# EAGLE design SEADLight (EAGLE 6.6.0)

## Sheet 1 of 3
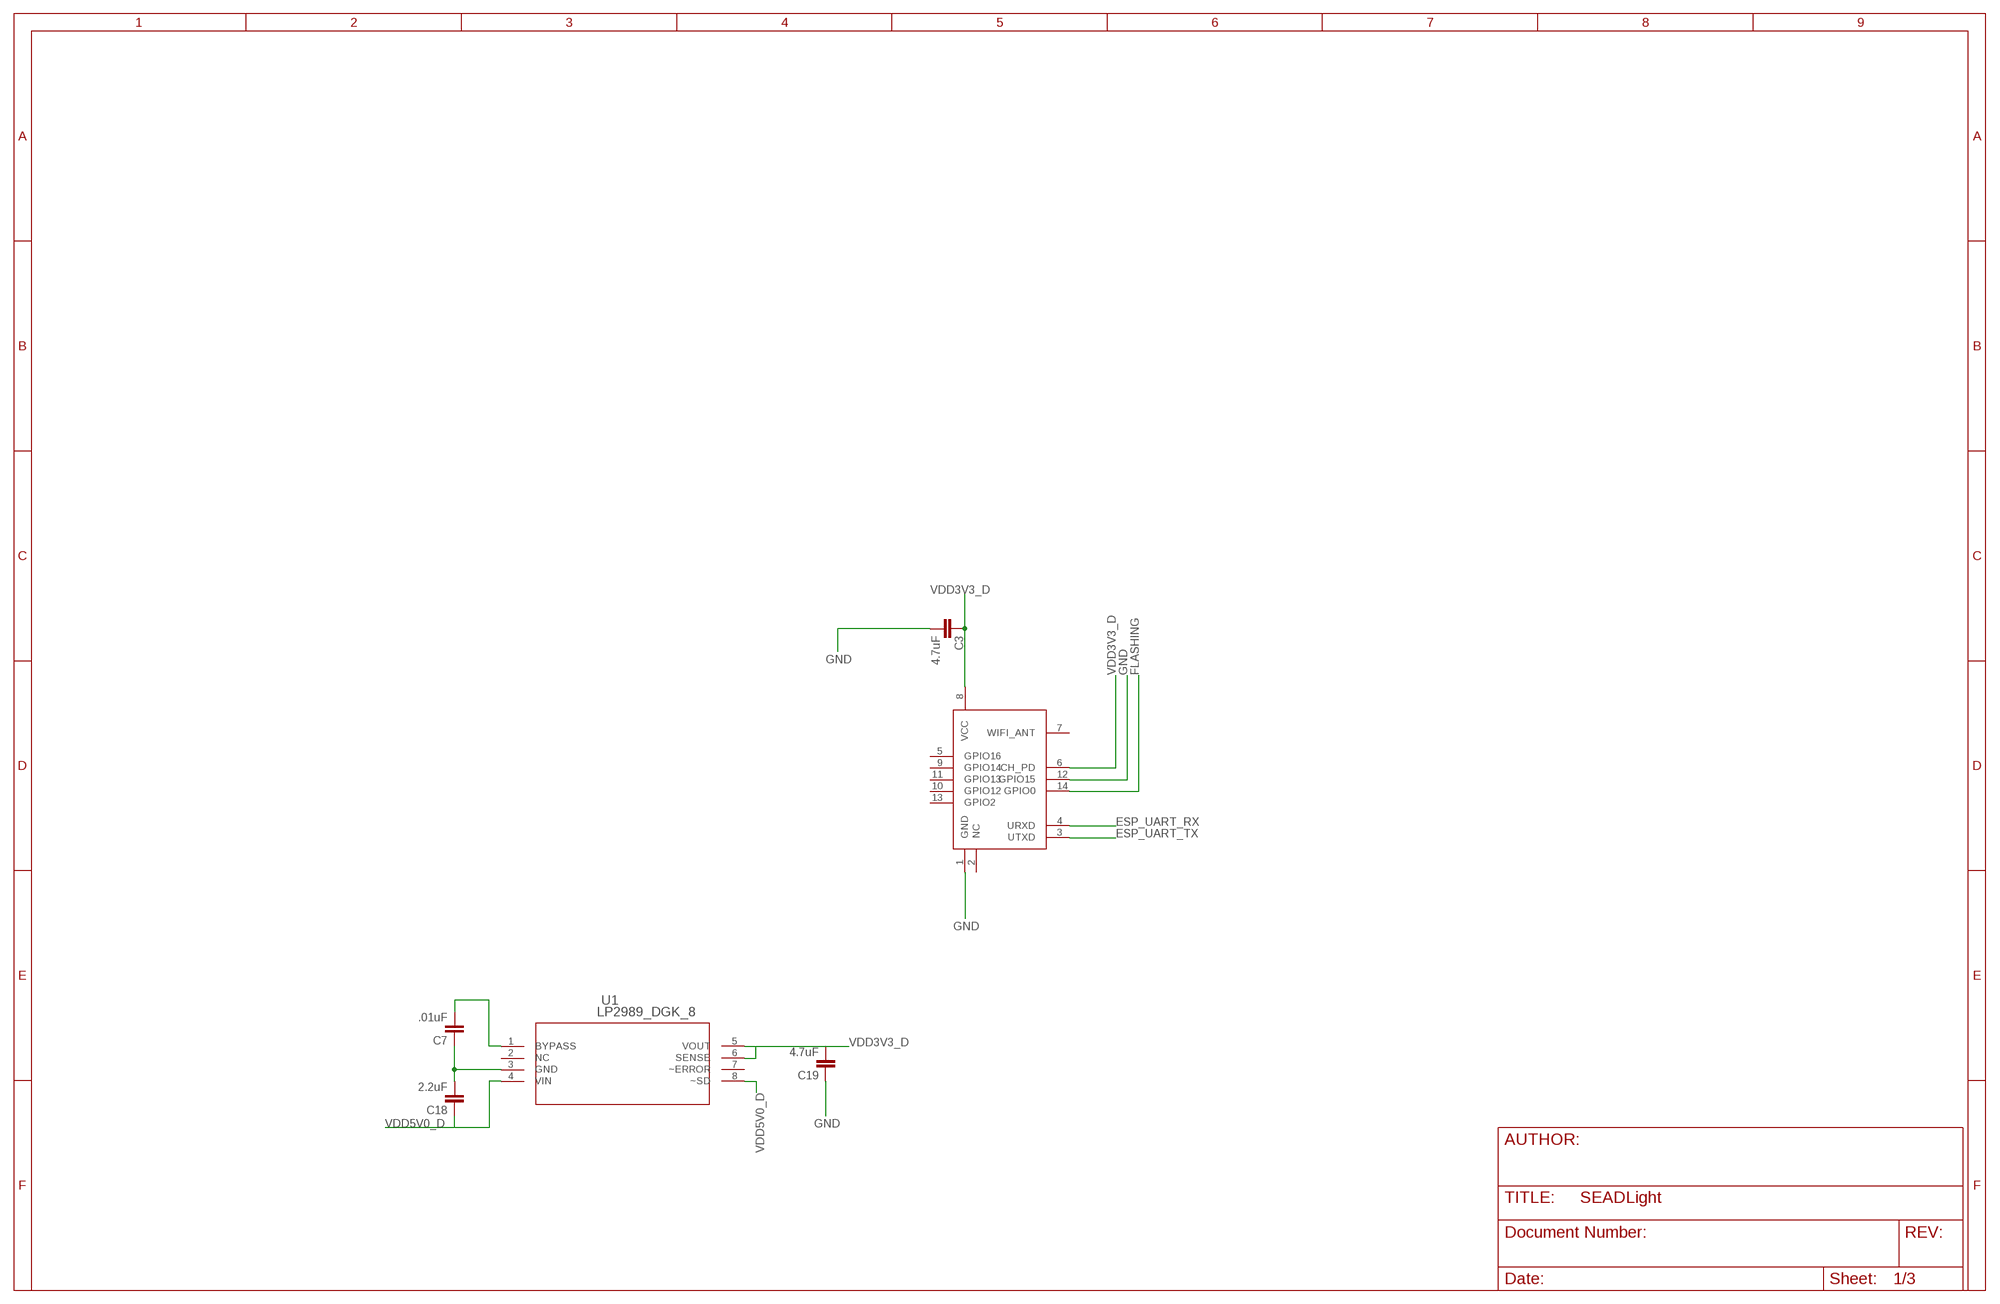
[diagram p0: schematic, sheet 1]

### Parts
C3  4.7uF  CAP0805  [0805]
C7  .01uF  CAP0805  [0805]
C18  2.2uF  CAP0805  [0805]
C19  4.7uF  CAP0805  [0805]
U1  LP2989_DGK_8  [MUA08A]
U$3  EPS8266  [ESP8266-03]

### Nets
ESP_UART_RX: U$3.4(URXD) ; also sheet 2
ESP_UART_TX: U$3.3(UTXD) ; also sheet 2
FLASHING: U$3.14(GPIO0)
GND: C3.2 C7.1 C18.2 C19.1 U1.3(GND) U$3.1(GND) U$3.12(GPIO15) ; also sheet 2
N$23: C7.2 U1.1(BYPASS)
VDD3V3_D: C3.1 C19.2 U1.5(VOUT) U1.6(SENSE) U$3.6(CH_PD) U$3.8(VCC) ; also sheet 2
VDD5V0_D: C18.1 U1.4(VIN) U1.8(~SD) ; also sheet 2
Unconnected: U1.2(NC) U1.7(~ERROR) U$3.2(NC) U$3.5(GPIO16) U$3.7(WIFI_ANT) U$3.9(GPIO14) U$3.10(GPIO12) U$3.11(GPIO13) U$3.13(GPIO2)

## Sheet 2 of 3
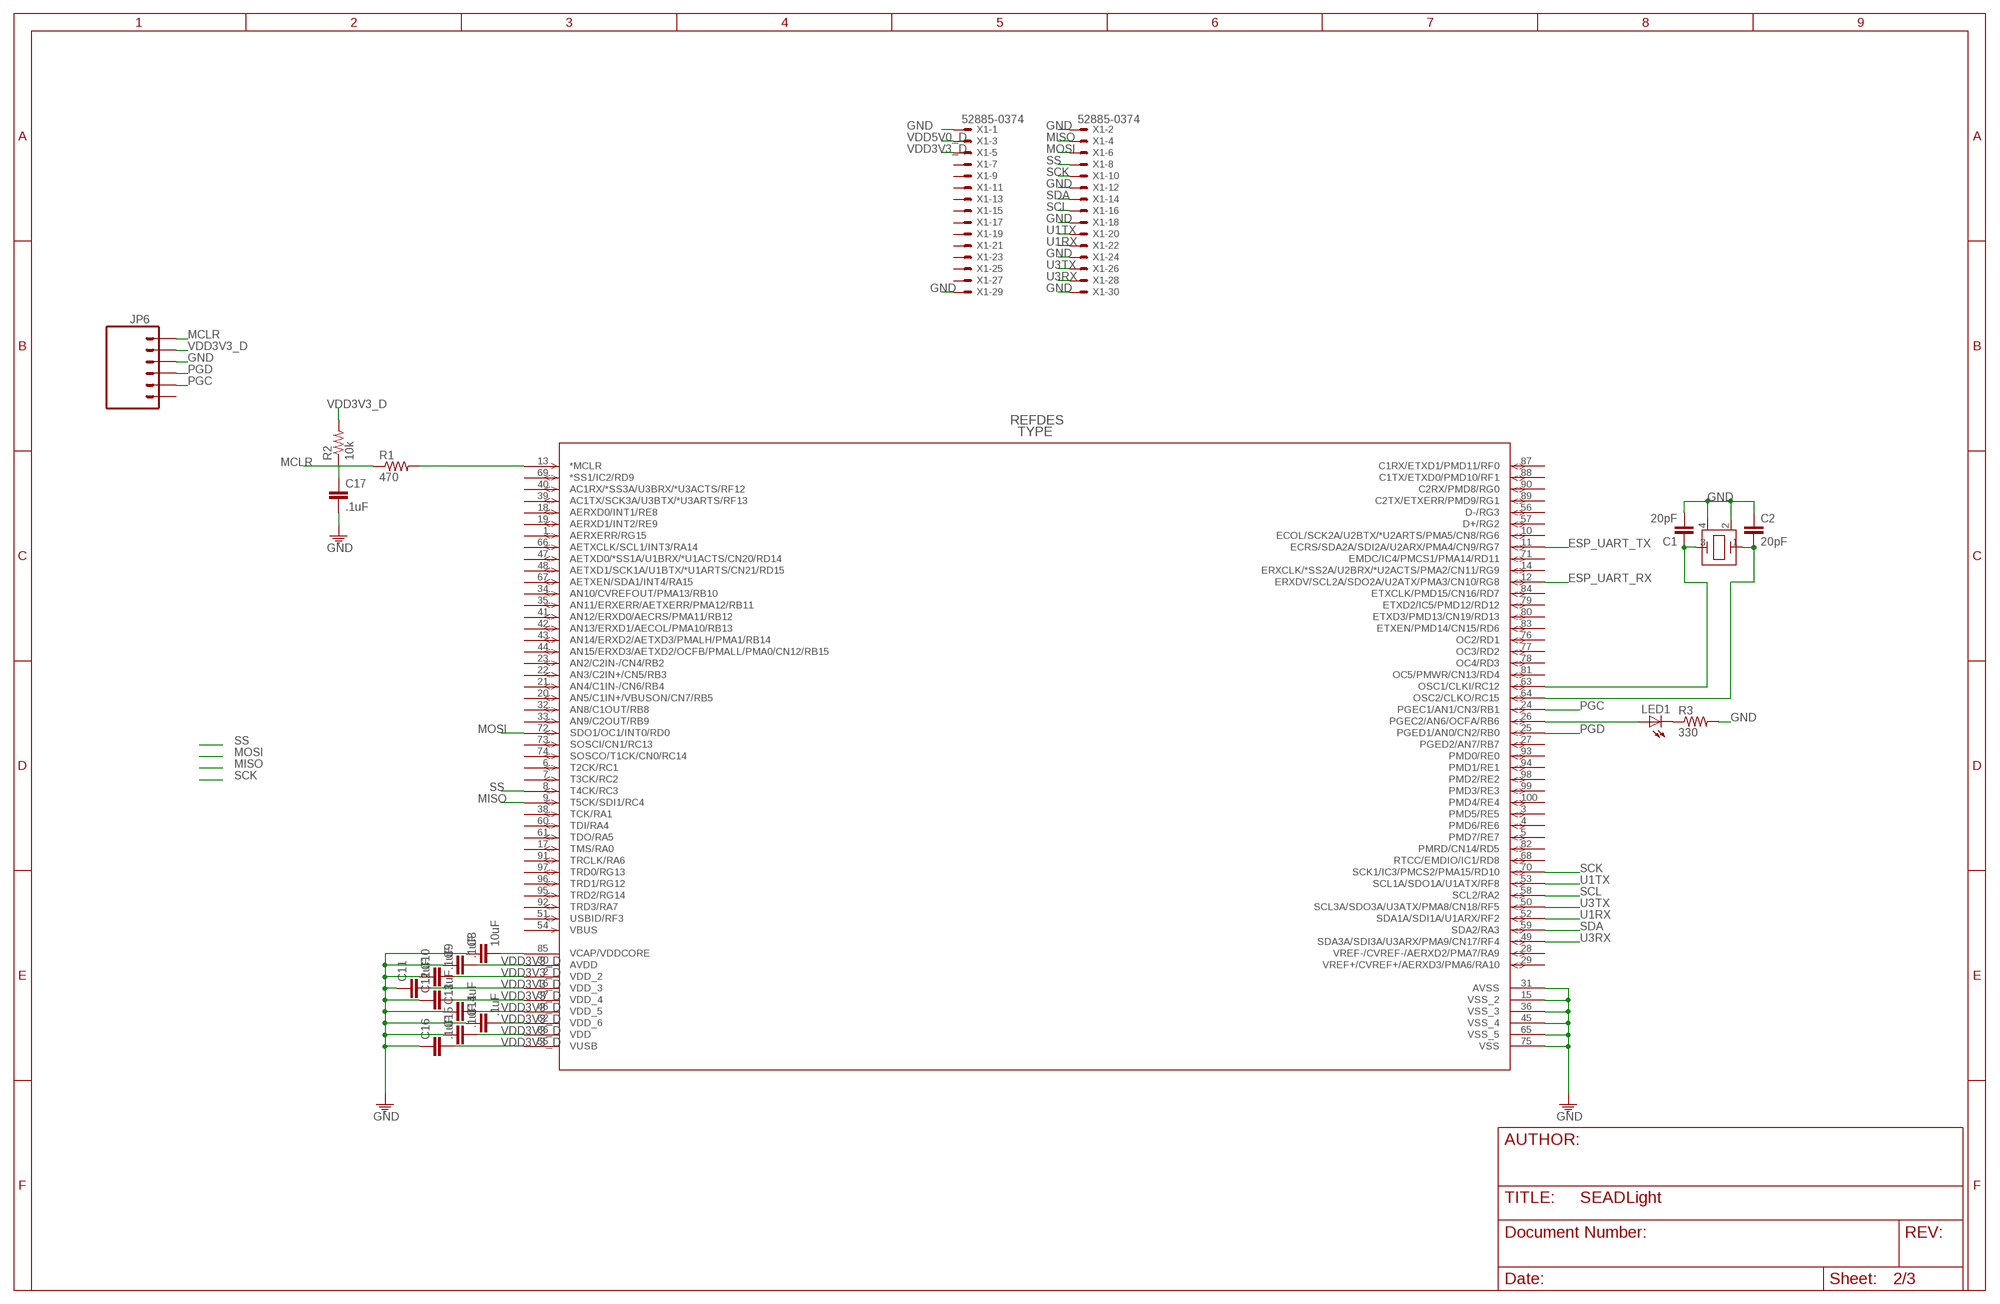
[diagram p1: schematic, sheet 2]

### Parts
C1  20pF  CAP0805  [0805]
C2  20pF  CAP0805  [0805]
C8  10uF  CAP0805  [0805]
C9  .1uF  CAP0805  [0805]
C10  .1uF  CAP0805  [0805]
C11  .1uF  CAP0805  [0805]
C12  .1uF  CAP0805  [0805]
C13  .1uF  CAP0805  [0805]
C14  .1uF  CAP0805  [0805]
C15  .1uF  CAP0805  [0805]
C16  .1uF  CAP0805  [0805]
C17  .1uF  CAP0805  [0805]
JP6  M06SIP_LOCK  [1X06-SIP_LOCK]
LED1  LED0805  [LED-0805]
R1  470  RESISTOR0805-RES  [0805]
R2  10k  RESISTOR0805-RES  [0805]
R3  330  RESISTOR0805-RES  [0805]
U$1  PIC32MX795F512L-  [TQFP100_12X12MC]
U$2  ABM3B-8.000MHZ-10-1-U-T  [ABM3B]
X1  52885-0374  [52885-0374]

### Nets
ESP_UART_RX: U$1.12(ERXDV/SCL2A/SDO2A/U2ATX/PMA3/CN10/RG8) ; also sheet 1
ESP_UART_TX: U$1.11(ECRS/SDA2A/SDI2A/U2ARX/PMA4/CN9/RG7) ; also sheet 1
GND: C1.2 C2.1 C8.1 C9.1 C10.1 C11.1 C12.1 C13.1 C14.1 C15.1 C16.1 C17.2 JP6.3 R3.2 U$1.15(VSS_2) U$1.31(AVSS) U$1.36(VSS_3) U$1.45(VSS_4) U$1.65(VSS_5) U$1.75(VSS) U$2.2(GND1) U$2.4(GND2) X1.1 X1.2 X1.12 X1.18 X1.24 X1.29 X1.30 ; also sheet 1
MCLR: C17.1 JP6.1 R1.1 R2.1
MISO: U$1.9(T5CK/SDI1/RC4) X1.4
MOSI: U$1.72(SDO1/OC1/INT0/RD0) X1.6
N$1: C1.1 U$1.63(OSC1/CLKI/RC12) U$2.3(OSC2)
N$2: C2.2 U$1.64(OSC2/CLKO/RC15) U$2.1(OSC1)
N$4: C8.2 U$1.85(VCAP/VDDCORE)
N$14: R1.2 U$1.13(*MCLR)
N$15: LED1.1(A) U$1.26(PGEC2/AN6/OCFA/RB6)
N$16: LED1.2(C) R3.1
PGC: JP6.5 U$1.24(PGEC1/AN1/CN3/RB1)
PGD: JP6.4 U$1.25(PGED1/AN0/CN2/RB0)
SCK: U$1.70(SCK1/IC3/PMCS2/PMA15/RD10) X1.10
SCL: U$1.58(SCL2/RA2) X1.16
SDA: U$1.59(SDA2/RA3) X1.14
SS: U$1.8(T4CK/RC3) X1.8
U1RX: U$1.52(SDA1A/SDI1A/U1ARX/RF2) X1.22
U1TX: U$1.53(SCL1A/SDO1A/U1ATX/RF8) X1.20
U3RX: U$1.49(SDA3A/SDI3A/U3ARX/PMA9/CN17/RF4) X1.28
U3TX: U$1.50(SCL3A/SDO3A/U3ATX/PMA8/CN18/RF5) X1.26
VDD3V3_D: C9.2 C10.2 C11.2 C12.2 C13.2 C14.2 C15.2 C16.2 JP6.2 R2.2 U$1.2(VDD_2) U$1.16(VDD_3) U$1.30(AVDD) U$1.37(VDD_4) U$1.46(VDD_5) U$1.55(VUSB) U$1.62(VDD_6) U$1.86(VDD) X1.5 ; also sheet 1
VDD5V0_D: X1.3 ; also sheet 1
Unconnected: JP6.6 U$1.1(AERXERR/RG15) U$1.3(PMD5/RE5) U$1.4(PMD6/RE6) U$1.5(PMD7/RE7) U$1.6(T2CK/RC1) U$1.7(T3CK/RC2) U$1.10(ECOL/SCK2A/U2BTX/*U2ARTS/PMA5/CN8/RG6) U$1.14(ERXCLK/*SS2A/U2BRX/*U2ACTS/PMA2/CN11/RG9) U$1.17(TMS/RA0) U$1.18(AERXD0/INT1/RE8) U$1.19(AERXD1/INT2/RE9) U$1.20(AN5/C1IN+/VBUSON/CN7/RB5) U$1.21(AN4/C1IN-/CN6/RB4) U$1.22(AN3/C2IN+/CN5/RB3) U$1.23(AN2/C2IN-/CN4/RB2) U$1.27(PGED2/AN7/RB7) U$1.28(VREF-/CVREF-/AERXD2/PMA7/RA9) U$1.29(VREF+/CVREF+/AERXD3/PMA6/RA10) U$1.32(AN8/C1OUT/RB8) U$1.33(AN9/C2OUT/RB9) U$1.34(AN10/CVREFOUT/PMA13/RB10) U$1.35(AN11/ERXERR/AETXERR/PMA12/RB11) U$1.38(TCK/RA1) U$1.39(AC1TX/SCK3A/U3BTX/*U3ARTS/RF13) U$1.40(AC1RX/*SS3A/U3BRX/*U3ACTS/RF12) U$1.41(AN12/ERXD0/AECRS/PMA11/RB12) U$1.42(AN13/ERXD1/AECOL/PMA10/RB13) U$1.43(AN14/ERXD2/AETXD3/PMALH/PMA1/RB14) U$1.44(AN15/ERXD3/AETXD2/OCFB/PMALL/PMA0/CN12/RB15) U$1.47(AETXD0/*SS1A/U1BRX/*U1ACTS/CN20/RD14) U$1.48(AETXD1/SCK1A/U1BTX/*U1ARTS/CN21/RD15) U$1.51(USBID/RF3) U$1.54(VBUS) U$1.56(D-/RG3) U$1.57(D+/RG2) U$1.60(TDI/RA4) U$1.61(TDO/RA5) U$1.66(AETXCLK/SCL1/INT3/RA14) U$1.67(AETXEN/SDA1/INT4/RA15) U$1.68(RTCC/EMDIO/IC1/RD8) U$1.69(*SS1/IC2/RD9) U$1.71(EMDC/IC4/PMCS1/PMA14/RD11) U$1.73(SOSCI/CN1/RC13) U$1.74(SOSCO/T1CK/CN0/RC14) U$1.76(OC2/RD1) U$1.77(OC3/RD2) U$1.78(OC4/RD3) U$1.79(ETXD2/IC5/PMD12/RD12) U$1.80(ETXD3/PMD13/CN19/RD13) U$1.81(OC5/PMWR/CN13/RD4) U$1.82(PMRD/CN14/RD5) U$1.83(ETXEN/PMD14/CN15/RD6) U$1.84(ETXCLK/PMD15/CN16/RD7) U$1.87(C1RX/ETXD1/PMD11/RF0) U$1.88(C1TX/ETXD0/PMD10/RF1) U$1.89(C2TX/ETXERR/PMD9/RG1) U$1.90(C2RX/PMD8/RG0) U$1.91(TRCLK/RA6) U$1.92(TRD3/RA7) U$1.93(PMD0/RE0) U$1.94(PMD1/RE1) U$1.95(TRD2/RG14) U$1.96(TRD1/RG12) U$1.97(TRD0/RG13) U$1.98(PMD2/RE2) U$1.99(PMD3/RE3) U$1.100(PMD4/RE4) X1.7 X1.9 X1.11 X1.13 X1.15 X1.17 X1.19 X1.21 X1.23 X1.25 X1.27

## Sheet 3 of 3
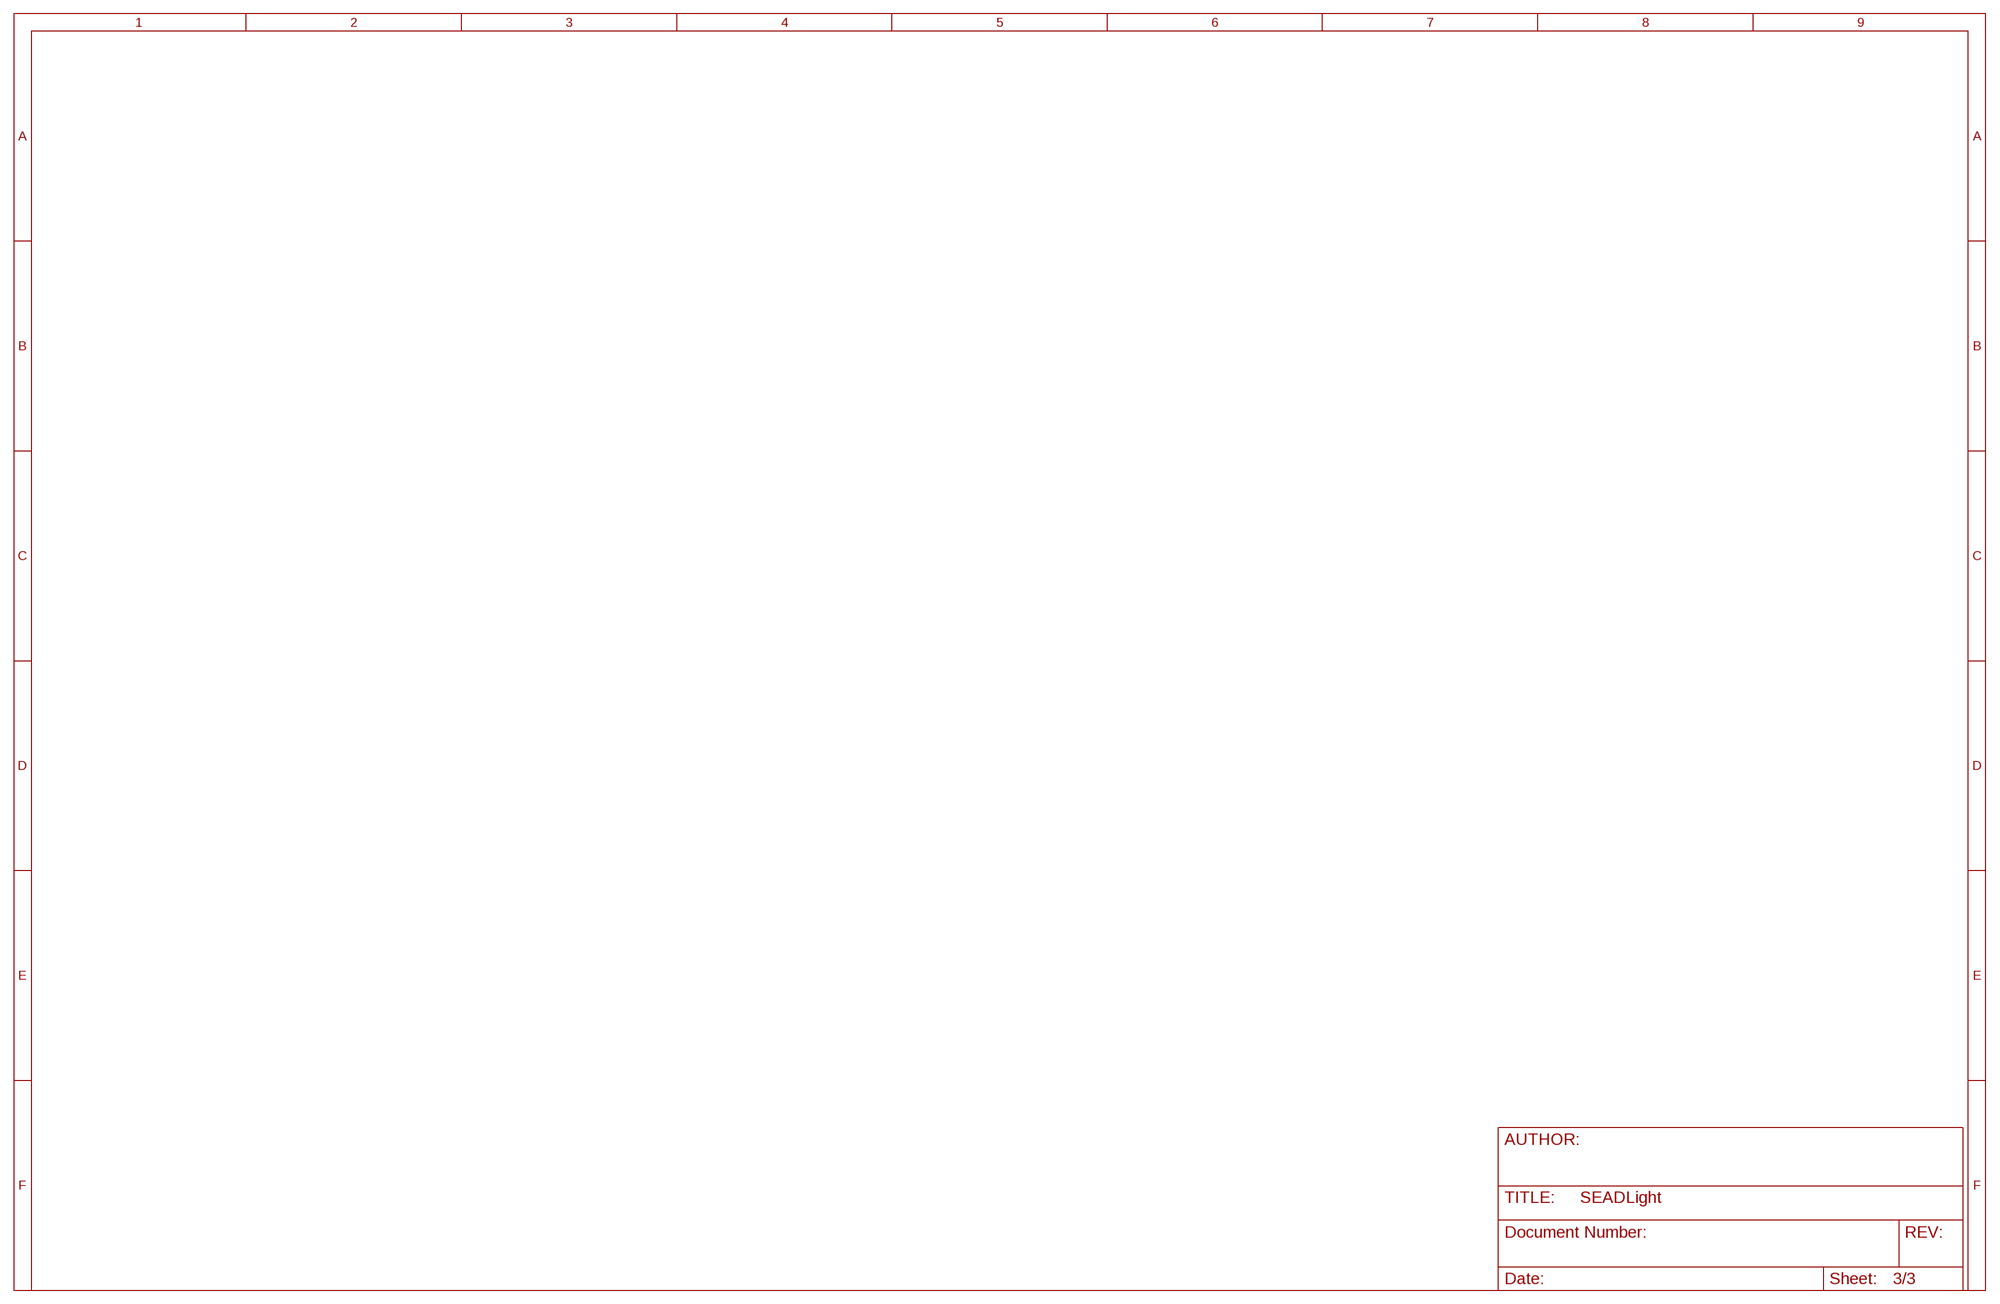
[diagram p2: schematic, sheet 3]

## Library data of the parts
C1-C3 C7-C19 = SensorCape:CAP: Capacitor Standard 0603 ceramic capacitor, and 0.1" leaded capacitor.
JP6 = ASL:M06: Header 6 Standard 6-pin 0.1" header. Use with straight break away headers (SKU : PRT-00116), right angle break away headers (PRT-00553), swiss pins (PRT-00743), machine pins (PRT-00117), and female headers (PRT-00115). Molex polarized connector foot print use with SKU : PRT-08094 with associated crimp pins and housings. NOTES ON THE VARIANTS LOCK and LOCK_LONGPADS... This footprint was designed to help hold the alignment of a through-hole component (i.e. 6-pin header) while soldering it into place. You may notice that each hole has been shifted either up or down by 0.005 of an inch from it's more standard position (which is a perfectly straight line). This slight alteration caused the pins (the squares in the middle) to touch the edges of the holes. Because they are alternating, it causes a "brace" to hold the component in place. 0.005 has proven to be the perfect amount of "off-center" position when using our standard breakaway headers. Although looks a little odd when you look at the bare footprint, once you have a header in there, the alteration is very hard to notice. Also, if you push a header all the way into place, it is covered up entirely on the bottom side. This idea of altering the position of holes to aid alignment will be further integrated into the Sparkfun Library for other footprints. It can help hold any component with 3 or more connection pins.
LED1 = ASL:LED: LEDs Standard schematic elements and footprints for 5mm, 3mm, 1206, and 0603 sized LEDs. 5mm - Spark Fun Electronics SKU : COM-00529 (and others)
R1-R3 = SensorCape:RESISTOR: Resistor Basic schematic elements and footprints for 0603, 1206, and PTH resistors.
U1 = SensorCape:LP2989_DGK_8; BASE_PN: LP2989; COMP: TypeLDO; LIBRARY: ReferenceLP2989AIMM; PARTNUMBER: LP2989AIMM-25; PIN: Count8; SYMBOL: NameLP2989AIMM-25; TYPE: LP2989AIMM-2.5; VENDOR: NationalSemiconductor; VERSION: 1
U$1 = SensorCape:PIC32MX795F512L-
U$2 = SensorCape:ABM3B-8.000MHZ-10-1-U-T
U$3 = SensorCape:EPS8266
X1 = SensorCape:52885-0374: MOLEX Connector SD-52760-**79 Source: 52760-1079_sd molex.pdf; MPN: 52760-0379; OC_FARNELL: unknown; OC_NEWARK: 92M6431

## Board
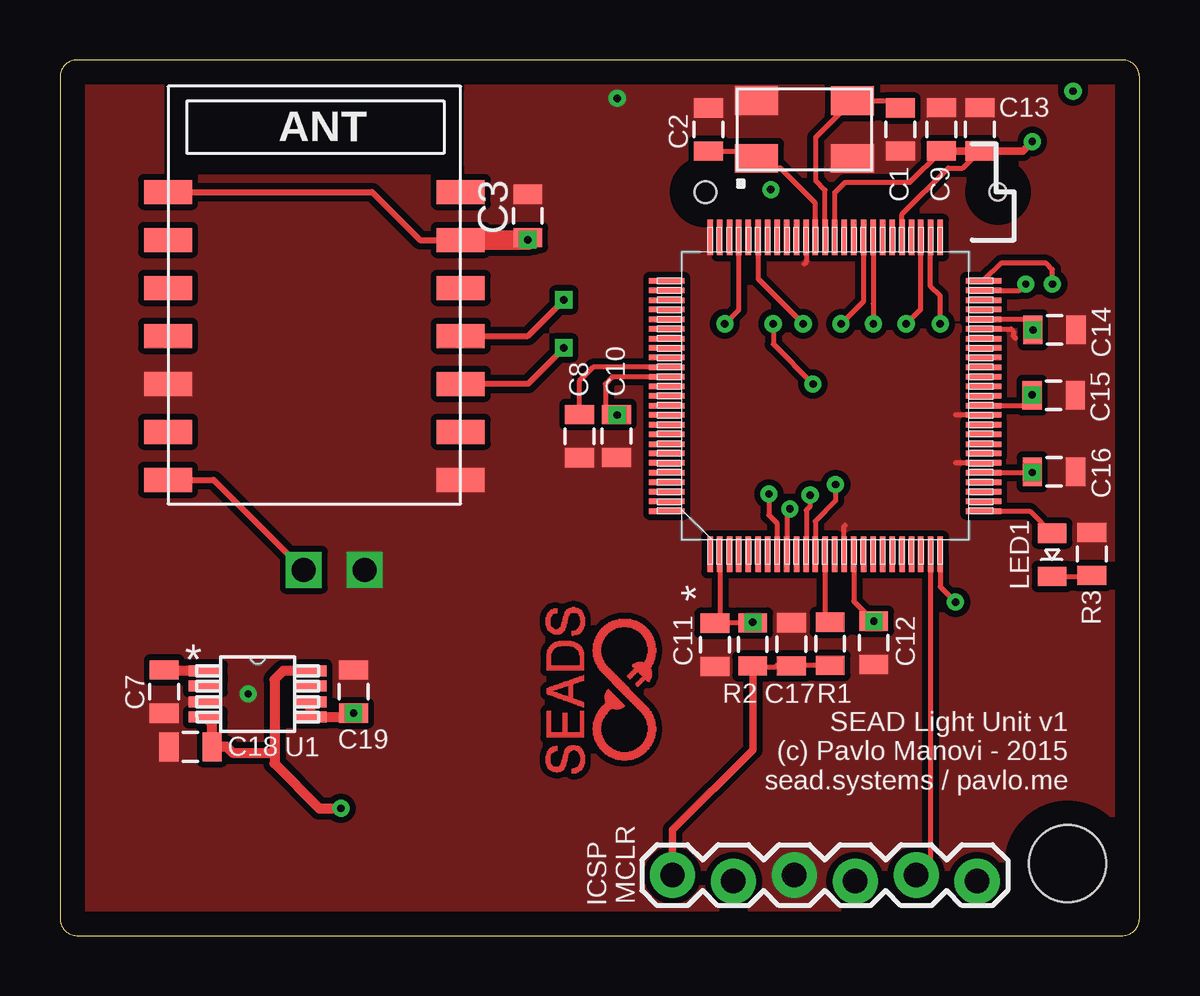
[diagram p3: board, top side]
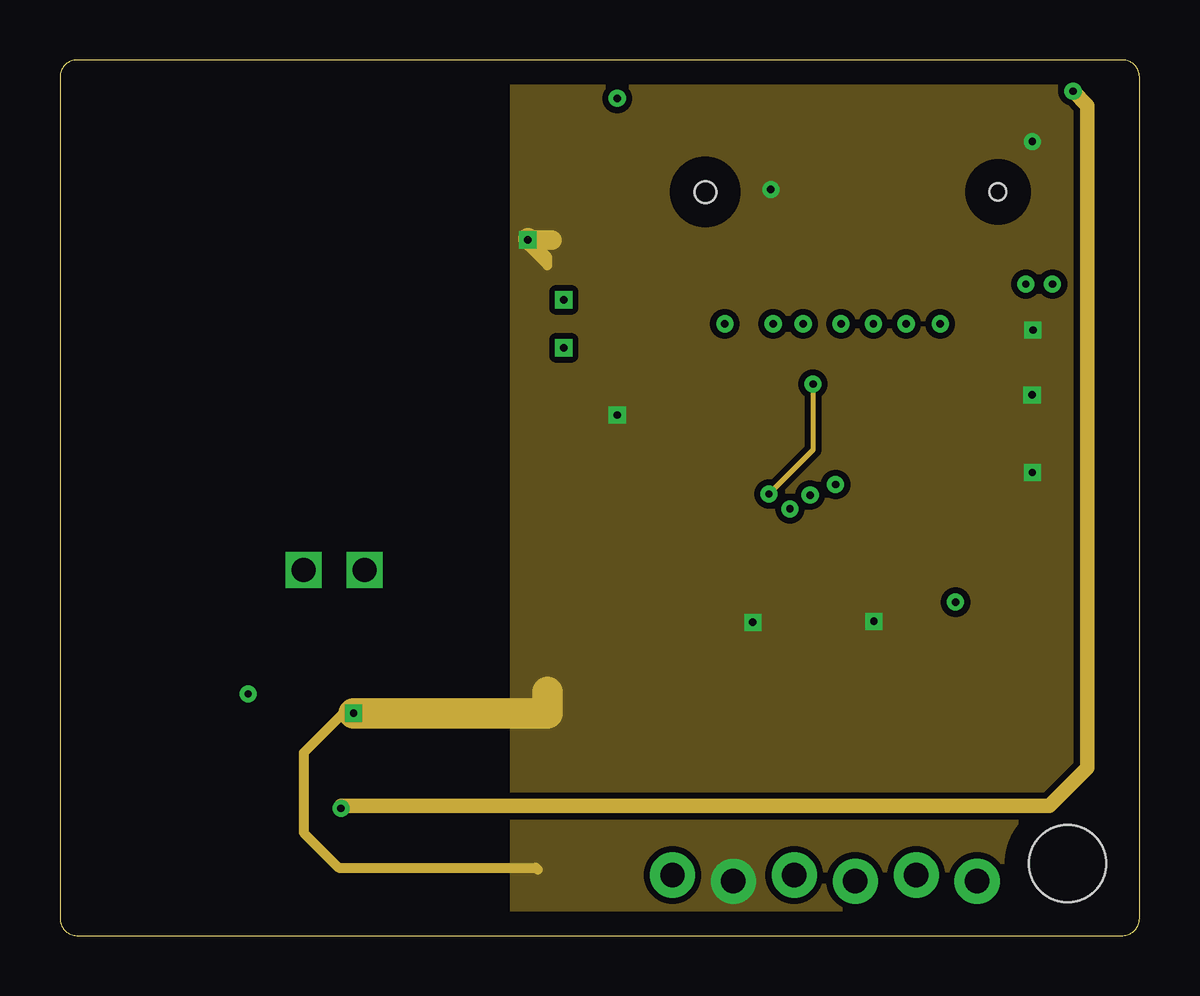
[diagram p4: board, inner layer Route14]
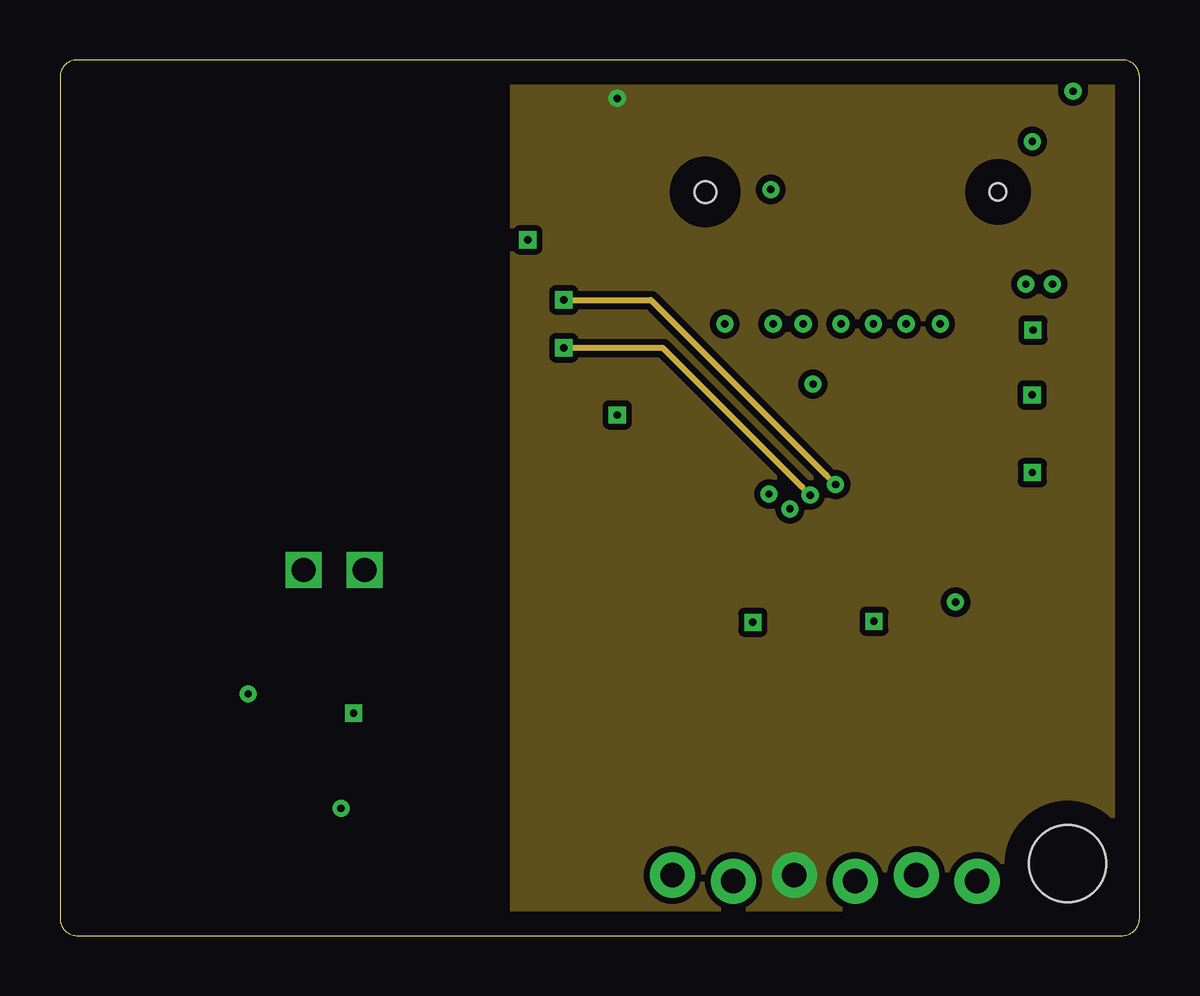
[diagram p5: board, inner layer Route15]
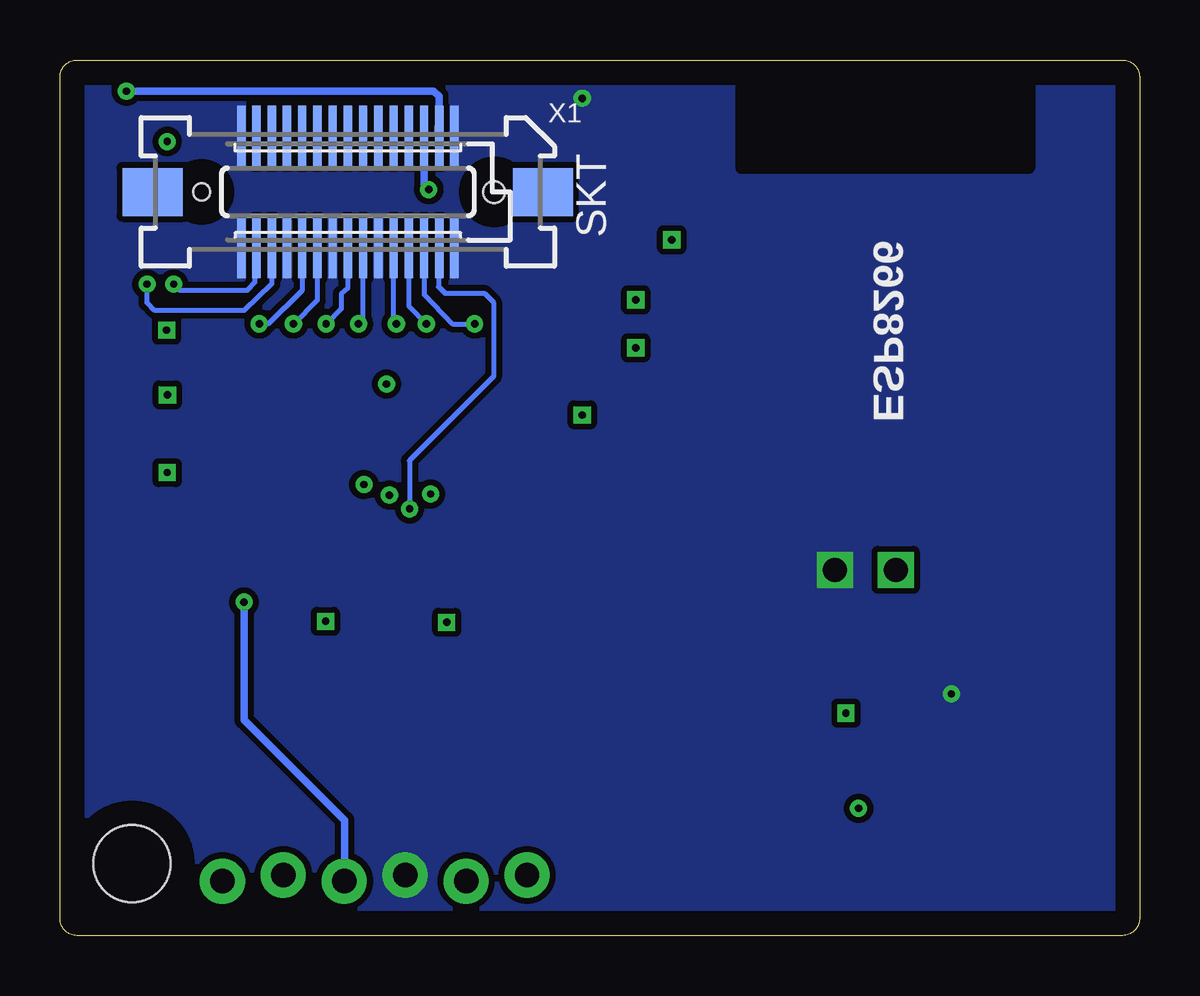
[diagram p6: board, bottom side, seen from below]

Size 45 x 36.5 mm. Coordinates in mm from the lower left corner, seen from the top.
Outline: 0.71,0 44.29,0 arc90 45,0.71 45,35.79 arc90 44.29,36.5 0.71,36.5 arc90 0,35.79 0,0.71 arc90 0.71,0
Copper layers (1*14+15*16): Top 0.035mm / dielectric 1.5mm / Route14 0.035mm / dielectric 0.15mm / Route15 0.035mm / dielectric 0.2mm / Bottom 0.035mm
Design rules "default *": minimum track width 10mil, minimum drill 24mil, track to track 8mil, track to pad 8mil, pad to pad 8mil, via to via 8mil, smd to smd 8mil, copper to edge 40mil, drill to drill 8mil, minimum pad ring 10mil, minimum via ring 8mil, stop-mask expansion 4mil, vias tented up to drill 0mil, thermal gap 10mil
Holes 3.2 mm at 42,3

### Footprints (pad centres in the part's own frame; a part is rotated, then mirrored left to right if it is on the bottom)
0805 = smd 0.8 x 1.2: 1 -0.9,0; 2 0.9,0
1X06-SIP_LOCK = drill 1.016 pad 1.88: 1 0,0; 2 2.54,-0.254; 3 5.08,0; 4 7.62,-0.254; 5 10.16,0; 6 12.7,-0.254
LED-0805 = smd 0.8 x 1.2: 1 -0.9,0; 2 0.9,0
MUA08A = smd 1.372 x 0.457: 1 -2.184,0.965; 2 -2.184,0.33; 3 -2.184,-0.33; 4 -2.184,-0.965; 5 2.184,-0.965; 6 2.184,-0.33; 7 2.184,0.33; 8 2.184,0.965
TQFP100_12X12MC = smd 1.473 x 0.229: 1 -6.604,4.801; 2 -6.604,4.394; 3 -6.604,3.988; 4 -6.604,3.607; 5 -6.604,3.2; 6 -6.604,2.794; 7 -6.604,2.388; 8 -6.604,2.007; 9 -6.604,1.6; 10 -6.604,1.194; 11 -6.604,0.787; 12 -6.604,0.406; 13 -6.604,0; 14 -6.604,-0.406; 15 -6.604,-0.787; 16 -6.604,-1.194; 17 -6.604,-1.6; 18 -6.604,-2.007; 19 -6.604,-2.388; 20 -6.604,-2.794; 21 -6.604,-3.2; 22 -6.604,-3.607; 23 -6.604,-3.988; 24 -6.604,-4.394; 25 -6.604,-4.801; 51 6.604,-4.801; 52 6.604,-4.394; 53 6.604,-3.988; 54 6.604,-3.607; 55 6.604,-3.2; 56 6.604,-2.794; 57 6.604,-2.388; 58 6.604,-2.007; 59 6.604,-1.6; 60 6.604,-1.194; 61 6.604,-0.787; 62 6.604,-0.406; 63 6.604,0; 64 6.604,0.406; 65 6.604,0.787; 66 6.604,1.194; 67 6.604,1.6; 68 6.604,2.007; 69 6.604,2.388; 70 6.604,2.794; 71 6.604,3.2; 72 6.604,3.607; 73 6.604,3.988; 74 6.604,4.394; 75 6.604,4.801 | smd 0.229 x 1.473: 26 -4.801,-6.604; 27 -4.394,-6.604; 28 -3.988,-6.604; 29 -3.607,-6.604; 30 -3.2,-6.604; 31 -2.794,-6.604; 32 -2.388,-6.604; 33 -2.007,-6.604; 34 -1.6,-6.604; 35 -1.194,-6.604; 36 -0.787,-6.604; 37 -0.406,-6.604; 38 0,-6.604; 39 0.406,-6.604; 40 0.787,-6.604; 41 1.194,-6.604; 42 1.6,-6.604; 43 2.007,-6.604; 44 2.388,-6.604; 45 2.794,-6.604; 46 3.2,-6.604; 47 3.607,-6.604; 48 3.988,-6.604; 49 4.394,-6.604; 50 4.801,-6.604; 76 4.801,6.604; 77 4.394,6.604; 78 3.988,6.604; 79 3.607,6.604; 80 3.2,6.604; 81 2.794,6.604; 82 2.388,6.604; 83 2.007,6.604; 84 1.6,6.604; 85 1.194,6.604; 86 0.787,6.604; 87 0.406,6.604; 88 0,6.604; 89 -0.406,6.604; 90 -0.787,6.604; 91 -1.194,6.604; 92 -1.6,6.604; 93 -2.007,6.604; 94 -2.388,6.604; 95 -2.794,6.604; 96 -3.2,6.604; 97 -3.607,6.604; 98 -3.988,6.604; 99 -4.394,6.604; 100 -4.801,6.604
ABM3B = smd 1.8 x 1.2: 1 -2,-1.2; 2 2,-1.2; 3 2,1.2; 4 -2,1.2
ESP8266-03 = smd 2 x 1: 1 12.2,1; 2 12.2,3; 3 12.2,5; 4 12.2,7; 5 12.2,9; 6 12.2,11; 7 12.2,13; 8 0,13; 9 0,11; 10 0,9; 11 0,7; 12 0,5; 13 0,3; 14 0,1
52885-0374 = smd 0.35 x 2.5: 1 -4.445,-2.35; 2 -4.445,2.35; 3 -3.81,-2.35; 4 -3.81,2.35; 5 -3.175,-2.35; 6 -3.175,2.35; 7 -2.54,-2.35; 8 -2.54,2.35; 9 -1.905,-2.35; 10 -1.905,2.35; 11 -1.27,-2.35; 12 -1.27,2.35; 13 -0.635,-2.35; 14 -0.635,2.35; 15 0,-2.35; 16 0,2.35; 17 0.635,-2.35; 18 0.635,2.35; 19 1.27,-2.35; 20 1.27,2.35; 21 1.905,-2.35; 22 1.905,2.35; 23 2.54,-2.35; 24 2.54,2.35; 25 3.175,-2.35; 26 3.175,2.35; 27 3.81,-2.35; 28 3.81,2.35; 29 4.445,-2.35; 30 4.445,2.35 | smd 2.5 x 2: M1 -8.137,0; M2 8.137,0 | hole 0.9: -6.098,0 | hole 0.7: 6.098,0

### Placement (x,y rotation side)
C1  35.03,33.6 270 top
C2  27.03,33.6 270 top
C3  19.5,30 90 top
C7  4.34,10.17 90 top
C8  21.66,20.82 90 top
C9  36.74,33.61 270 top
C10  23.2,20.82 90 top
C11  27.3,12.12 90 top
C12  33.92,12.2 90 top
C13  38.34,33.61 270 top
C14  41.46,25.25 180 top
C15  41.42,22.52 180 top
C16  41.43,19.33 180 top
C17  30.48,12.14 90 top
C18  5.44,7.87 180 top
C19  12.24,10.17 270 top
JP6  25.53,2.52 0 top
LED1  41.35,15.87 270 top
R1  32.1,12.16 90 top
R2  28.88,12.13 90 top
R3  43.01,15.9 90 top
U1  8.24,10.07 0 top
U$1  31.89,22.5 90 top
U$2  31.03,33.6 0 top
U$3  4.5,18 0 top
X1  33,31 180 bottom

### Tracks (layer width: path | path; a pad name or v marks a point on that pad's centre or on a via)
ESP_UART_RX  (via drill 0.3)
  Top 0.203: v32.33,18.8 32.33,18.13 31.48,17.28 U$1.12
  Top 0.254: U$3.4 19.5,25 v21,26.5
  Route15 0.203: 31.93,19.2 v32.33,18.8
  Route15 0.254: v21,26.5 24.63,26.5 31.93,19.2
ESP_UART_TX  (via drill 0.3)
  Top 0.203: v31.27,18.36 31.27,17.89 31.11,17.73 U$1.11
  Top 0.254: v21,24.5 19.5,23 U$3.3
  Route15 0.203: 30.93,18.7 v31.27,18.36
  Route15 0.254: 30.93,18.7 25.13,24.5 v21,24.5
FLASHING  (via drill 1)
  Top 0.254: U$3.14 6.4,19 v10.16,15.24
GND  (via drill 0.3, 1)
  Top 0.203: U$1.65 31.11,28.08 31.03,28 | U$1.15 32.68,17.05 32.73,17.1 | U$1.31 37.33,19.7 | U$1.36 37.34,21.71 37.33,21.7 | U$1.45 39.64,25.29 39.73,25.2 39.73,25 39.83,24.9
  other vias: 7.84,10.07 23.23,34.9 12.7,15.24
  pour Top (isolate 0.254, rank 3, no thermals): -1.47,0.1 -1.47,36.9 45.07,36.8 45.07,0
  pour Bottom (isolate 0.254, no thermals): 44.95,0 44.95,36.8 -1.47,36.8 -1.47,0
  pour Route15 (isolate 0.254, no thermals): 44.95,0 44.95,36.8 18.86,36.8 18.86,0
MCLR
  Top 0.203: R1.1 30.51,11.26 C17.1 30.43,11.3 29.93,11.3 29.83,11.2 29.13,11.2 | R2.1 29.09,11.23 29.13,11.2 | 29.13,11.2 28.93,11.2
  Top 0.305: R2.1 28.88,7.75 25.53,4.4 JP6.1
MISO  (via drill 0.3)
  Top 0.203: U$1.9 30.3,17.66 v30.43,17.79
  Bottom 0.203: X1.4 29.22,27.05 28.95,26.78 27.31,26.78 26.93,26.4 26.93,23.3 30.43,19.8 v30.43,17.79
MOSI  (via drill 0.3)
  Top 0.203: U$1.72 28.29,26.08 v27.71,25.5
  Bottom 0.203: X1.6 29.81,28.61 29.81,26.71 28.64,25.5 v27.71,25.5
N$1
  Top 0.203: U$1.63 31.89,31.07 31.51,31.46 31.51,33.28 U$2.3 34.73,34.8 C1.1
N$2
  Top 0.203: U$1.64 31.49,30.54 30.03,32 29.43,32 U$2.1 28.73,32.7 C2.2
N$4
  Top 0.203: U$1.85 22.22,23.69 21.66,23.13 C8.2
N$14
  Top 0.203: U$1.13 31.89,13.27 R1.2
N$15
  Top 0.203: U$1.26 40.43,17.69 LED1.1
N$16
  Top 0.203: LED1.2 42.98,14.97 R3.1
N$23
  Top 0.406: U1.1 4.38,11.04 C7.2
N$25
  Top 0.025: 24.58,7.83 24.58,9.38
PGC
  Top 0.203: U$1.24 36.29,3.12 JP6.5
PGD  (via drill 0.3)
  Top 0.203: U$1.25 36.7,14.53 v37.33,13.9
  Bottom 0.305: v37.33,13.9 37.33,9 33.13,4.8 33.13,2.29 JP6.4
SCK  (via drill 0.3)
  Top 0.203: U$1.70 29.1,27.38 v30.98,25.5
  Bottom 0.203: X1.10 31.09,25.62 v30.98,25.5
SCL  (via drill 0.3)
  Top 0.203: U$1.58 33.9,26.34 v33.91,25.5
  Bottom 0.203: X1.16 33,27 33.28,26.75 33.28,26.13 v33.91,25.5
SDA  (via drill 0.3)
  Top 0.203: U$1.59 33.49,26.43 v32.56,25.5
  Bottom 0.203: X1.14 32.37,25.66 v32.56,25.5
SS  (via drill 0.3)
  Top 0.203: v29.55,18.41 29.55,17.53 29.88,17.2 U$1.8 | v29.73,25.5 29.73,24.65 v31.39,22.99
  Route14 0.203: v31.39,22.99 31.39,20.25 v29.55,18.41
  Bottom 0.203: X1.8 30.46,26.24 v29.73,25.5
U1RX  (via drill 0.3)
  Top 0.203: v36.69,25.5 36.69,26.66 36.29,27.06 U$1.52
  Bottom 0.203: X1.22 34.91,26.89 36.32,25.5 v36.69,25.5
U1TX  (via drill 0.3)
  Top 0.203: U$1.53 35.88,26.11 v35.27,25.5
  Bottom 0.203: X1.20 34.28,26.48 v35.27,25.5
U3RX  (via drill 0.3)
  Top 0.203: U$1.49 39.99,26.89 v40.26,27.16
  Bottom 0.203: v40.26,27.16 v40.26,27.15 40.01,26.9 37.18,26.9 36.87,27.23 36.86,28.63 X1.28
U3TX  (via drill 0.3)
  Top 0.203: U$1.50 39.23,28.03 41.11,28.03 41.37,27.77 v41.37,27.16
  Bottom 0.203: X1.26 36.17,27.16 37.32,26.06 41.05,26.06 41.37,26.38 v41.37,27.16
VDD3V3_D  (via drill 0.3)  (1 unrouted)
  Top 0.203: U$1.86 23.01,23.28 22.73,23 22.73,21.65 C10.2 v23.23,21.7 | U$1.30 40.49,19.3 C16.2 v40.53,19.3 | U$1.37 40.49,22.09 C15.2 40.53,22.51 v40.52,22.54 | U$1.46 40.5,25.7 C14.2 40.53,25.28 v40.56,25.24 | U$1.16 33.09,13.93 C12.2 | U$1.2 27.5,13.23 C11.2 27.31,13.04 R2.2 | U$1.62 32.3,30.97 32.73,31.4 35.43,31.4 C9.2 | U$1.55 35.09,30.07 37.03,32 37.63,32 C13.2
  Top 0.254: U$3.8 13,31 15,29 U$3.6
  Top 0.305: v40.53,33.1 40.14,32.71 C13.2 C9.2
  Top 0.406: U1.6 U1.5 12.07,9.11 C19.2 | R2.2 v28.88,13.06 | v33.93,13.1 C12.2
  Top 0.813: U$3.6 v19.5,29
  Route14 0.406: C19.2 11.81,9.27 10.16,7.62 10.16,4.29 11.62,2.83 19.84,2.83 19.92,2.75 | C3.1 19.5,28.76 20.32,27.94 20.32,28.28 C3.1
  Route14 0.813: 20.5,29 v19.5,29 C3.1
  Route14 1.27: C19.2 20.32,9.27 20.32,10.16
  Bottom 0.305: X1.5 29.82,31.32 v29.63,31.1
  other vias: 12.24,9.27
  pour Route14 (isolate 0.254, no thermals): 44.95,0 44.95,36.8 18.86,36.8 18.86,0
VDD5V0_D  (via drill 0.3)
  Top 0.406: U1.4 6.34,8.82 C18.1 6.94,7.87 7.19,7.62 8.94,7.62 | U1.8 9.3,11.04 8.94,10.67 8.94,7.62 | 8.94,7.62 8.94,7.17 10.81,5.3 v11.71,5.3
  Route14 0.406: 11.71,5.4 v11.71,5.3
  Route14 0.61: 11.71,5.4 41.23,5.4 42.83,7 42.83,34.6 v42.23,35.2
  Bottom 0.305: v42.23,35.2 29.43,35.2 29.19,35 29.23,33.36 X1.3
(copper drawn outside any net)
  shapes: Top area x730

### Text on the board
tNames: SEAD Light Unit v1 / (c) Pavlo Manovi - 2015 / sead.systems / pavlo.me | ICSP | MCLR